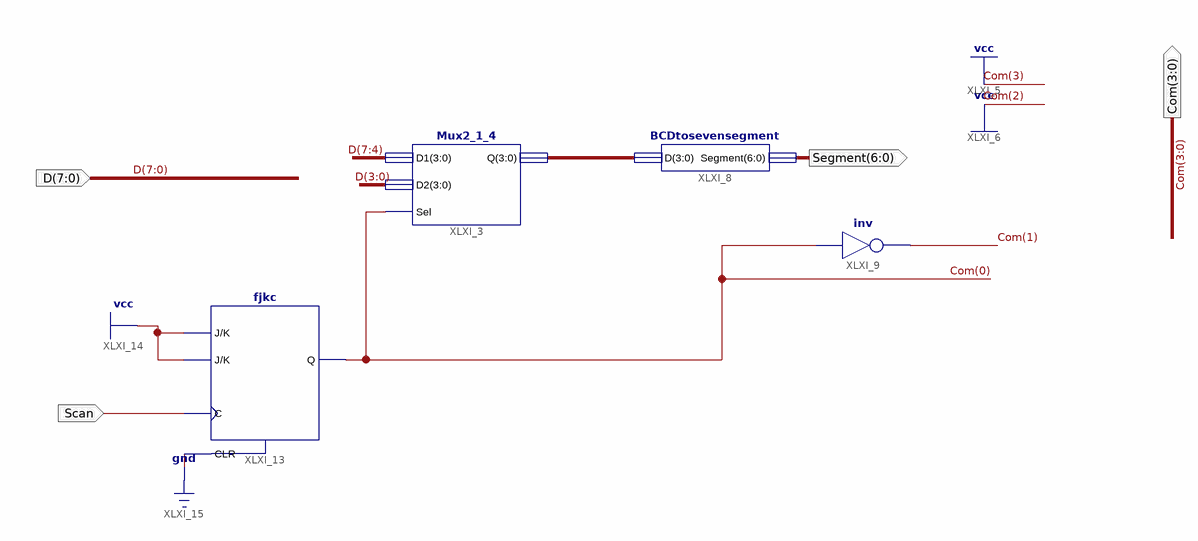
[diagram p0: schematic sheet 1]
// Xilinx ISE schematic Display.sch (spartan6) as structural Verilog: 4 symbols, 4 ports
module Display (
  input  [7:0] D,
  input  Scan,
  output [3:0] Com,
  output [6:0] Segment
);

  wire [3:0] XLXN_13;

  Mux2_1_4 XLXI_3 (.D1(D[7:4]), .D2(D[3:0]), .Q(XLXN_13), .Sel(Com[0]));
  BCDtosevensegment XLXI_8 (.D(XLXN_13), .Segment(Segment));
  not XLXI_9 (Com[1], Com[0]);
  fjkc XLXI_13 (.C(Scan), .CLR(1'b0), .J(1'b1), .K(1'b1), .Q(Com[0]));

  assign Com[3:2] = 2'b11;
endmodule
